# Altium schematic sheet Jumper.SchDoc
size A
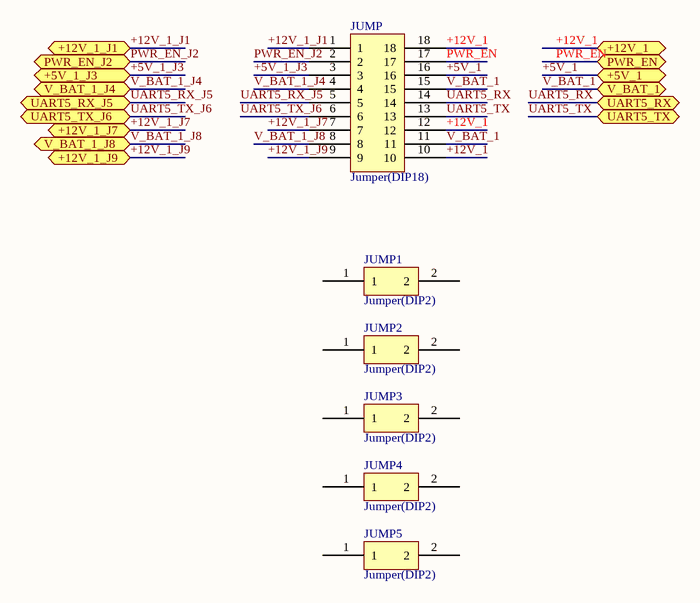
[diagram p0: Jumper.SchDoc]

## Parts
JUMP  Jumper(DIP18)  [Jumper(DIP18)]
JUMP1  Jumper(DIP2)  [Jumper(DIP2)]
JUMP2  Jumper(DIP2)  [Jumper(DIP2)]
JUMP3  Jumper(DIP2)  [Jumper(DIP2)]
JUMP4  Jumper(DIP2)  [Jumper(DIP2)]
JUMP5  Jumper(DIP2)  [Jumper(DIP2)]

## Ports
+5V_1 (bidir), +5V_1_J3 (bidir), +12V_1 (bidir), +12V_1_J1 (bidir), +12V_1_J7 (bidir), +12V_1_J9 (bidir), PWR_EN (bidir), PWR_EN_J2 (bidir), UART5_RX (bidir), UART5_RX_J5 (bidir), UART5_TX (bidir), UART5_TX_J6 (bidir), V_BAT_1 (bidir), V_BAT_1_J4 (bidir), V_BAT_1_J8 (bidir)

## Nets
+5V_1: JUMP.16 ; port +5V_1
+5V_1_J3: JUMP.3 ; port +5V_1_J3
+12V_1: JUMP.10 JUMP.12 JUMP.18 ; port +12V_1
+12V_1_J1: JUMP.1 ; port +12V_1_J1
+12V_1_J7: JUMP.7 ; port +12V_1_J7
+12V_1_J9: JUMP.9 ; port +12V_1_J9
PWR_EN: JUMP.17 ; port PWR_EN
PWR_EN_J2: JUMP.2 ; port PWR_EN_J2
UART5_RX: JUMP.14 ; port UART5_RX
UART5_RX_J5: JUMP.5 ; port UART5_RX_J5
UART5_TX: JUMP.13 ; port UART5_TX
UART5_TX_J6: JUMP.6 ; port UART5_TX_J6
V_BAT_1: JUMP.11 JUMP.15 ; port V_BAT_1
V_BAT_1_J4: JUMP.4 ; port V_BAT_1_J4
V_BAT_1_J8: JUMP.8 ; port V_BAT_1_J8

Not connected (* = marked no-connect by the designer): JUMP1 1 2; JUMP2 1 2; JUMP3 1 2; JUMP4 1 2; JUMP5 1 2